# Altium project stlinkv2.PrjPcb
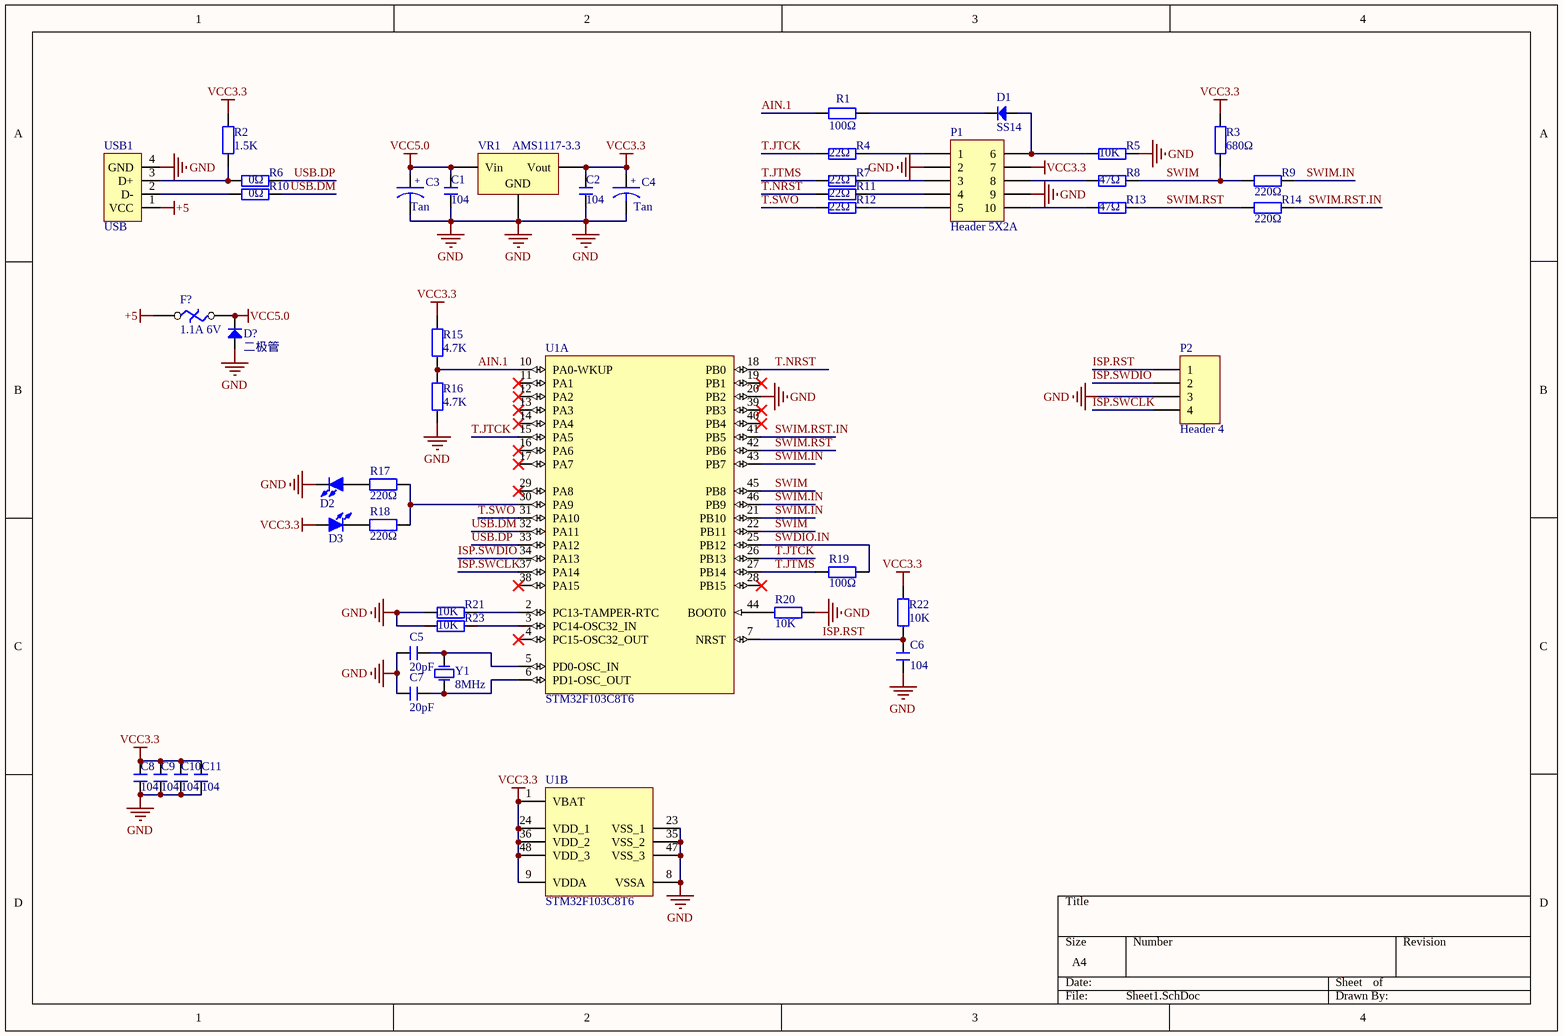
[diagram p0: Sheet1.SchDoc]
1 sheet, 45 parts. Net scope: global (net labels, ports and power ports of the same name join across sheets).
Board file: PCB1.PcbDoc

## Sheet Sheet1.SchDoc
size A4

### Parts
C1  104  [LC-1206_C]
C2  104  [LC-1206_C]
C3  Tan  [LC-CASE-A_3216]
C4  Tan  [LC-CASE-A_3216]
C5  20pF  [LC-1206_C]
C6  104  [LC-1206_C]
C7  20pF  [LC-1206_C]
C8  104  [LC-1206_C]
C9  104  [LC-1206_C]
C10  104  [LC-1206_C]
C11  104  [LC-1206_C]
D1  SS14  [LL4108]
D2  LED-SMD  [LC-0805_LED_S1]  (value not drawn)
D3  LED-SMD  [LC-0805_LED_S1]  (value not drawn)
D?  二极管  [LL4108]
F?  1.1A 6V  [LC-1206_R]
P1  Header 5X2A  [HDR2X5_CEN]
P2  Header 4  [HDR1X4]
R1  100Ω  [LC-0402_R]
R2  1.5K  [LC-0402_R]
R3  680Ω  [LC-0402_R]
R4  22Ω  [LC-0402_R]
R5  10K  [LC-0402_R]
R6  0Ω  [LC-0402_R]
R7  22Ω  [LC-0402_R]
R8  47Ω  [LC-0402_R]
R9  220Ω  [LC-0402_R]
R10  0Ω  [LC-0402_R]
R11  22Ω  [LC-0402_R]
R12  22Ω  [LC-0402_R]
R13  47Ω  [LC-0402_R]
R14  220Ω  [LC-0402_R]
R15  4.7K  [LC-0402_R]
R16  4.7K  [LC-0402_R]
R17  220Ω  [LC-0402_R]
R18  220Ω  [LC-0402_R]
R19  100Ω  [LC-0402_R]
R20  10K  [LC-0402_R]
R21  10K  [LC-0402_R]
R22  10K  [LC-0402_R]
R23  10K  [LC-0402_R]
U1  STM32F103C8T6  [STM-LQFP48_N]  (parts A,B of 2)
USB1  USB  [USB_A/P_B]
VR1  AMS1117-3.3  [LC-SOT-223]
Y1  8MHz  [OSC HC-49S]

### Nets
+5: F?.1 USB1.1(VCC)
GND: C1.2 C2.2 C3.2 C4.2 C5.1 C6.2 C7.1 C8.2 C9.2 C10.2 C11.2 D2.2(K) D?.1 P1.2 P1.9 P2.3 R5.1 R16.1 R20.1 R21.2 R23.2 U1.8(VSSA) U1.20(PB2) U1.23(VSS_1) U1.35(VSS_2) U1.47(VSS_3) USB1.4(GND) VR1.1(GND)
VCC3.3: C2.1 C4.1 C8.1 C9.1 C10.1 C11.1 D3.1(A) P1.7 R2.1 R3.1 R15.2 R22.1 U1.1(VBAT) U1.9(VDDA) U1.24(VDD_1) U1.36(VDD_2) U1.48(VDD_3) VR1.2(Vout)
VCC5.0: C1.1 C3.1 D?.2 F?.2 VR1.3(Vin)
AIN.1: R1.2 R15.1 R16.2 U1.10(PA0-WKUP)
ISP.RST: C6.1 P2.1 R22.2 U1.7(NRST)
ISP.SWCLK: P2.4 U1.37(PA14)
ISP.SWDIO: P2.2 U1.34(PA13)
SWDIO.IN: R19.1 U1.25(PB12)
SWIM: R3.2 R8.1 R9.1 U1.22(PB11) U1.45(PB8)
SWIM.IN: R9.2 U1.21(PB10) U1.43(PB7) U1.46(PB9)
SWIM.RST: R13.1 R14.1 U1.42(PB6)
SWIM.RST.IN: R14.2 U1.41(PB5)
T.JTCK: R4.2 U1.15(PA5) U1.26(PB13)
T.JTMS: R7.2 R19.2 U1.27(PB14)
T.NRST: R11.2 U1.18(PB0)
T.SWO: R12.2 U1.31(PA10)
USB.DM: R10.1 U1.32(PA11)
USB.DP: R6.1 U1.33(PA12)
NetC5_2: C5.2 U1.5(PD0-OSC_IN) Y1.2(OSC2)
NetC7_2: C7.2 U1.6(PD1-OSC_OUT) Y1.1(OSC1)
NetD1_1: D1.1 P1.6 R5.2
NetD1_2: D1.2 R1.1
NetD2_1: D2.1(A) R17.1
NetD3_2: D3.2(K) R18.1
NetP1_1: P1.1 R4.1
NetP1_3: P1.3 R7.1
NetP1_4: P1.4 R11.1
NetP1_5: P1.5 R12.1
NetP1_8: P1.8 R8.2
NetP1_10: P1.10 R13.2
NetR2_2: R2.2 R6.2 USB1.3(D+)
NetR10_2: R10.2 USB1.2(D-)
NetR17_2: R17.2 R18.2 U1.30(PA9)
NetR20_2: R20.2 U1.44(BOOT0)
NetR21_1: R21.1 U1.2(PC13-TAMPER-RTC)
NetR23_1: R23.1 U1.3(PC14-OSC32_IN)

Not connected (* = marked no-connect by the designer): U1 4(PC15-OSC32_OUT)* 11(PA1)* 12(PA2)* 13(PA3)* 14(PA4)* 16(PA6)* 17(PA7)* 19(PB1)* 28(PB15)* 29(PA8)* 38(PA15)* 39(PB3)* 40(PB4)*

### Notes on the sheet
- (in symbol CAP-T) +

### Library data of the parts
C1 C2 C5-C11 = C: 无极性贴片电容; 版权归属: 源创客; BOM名称: 无极性贴片电容; 学习资源: www.ooocke.com
C3 C4 = CAP-T: 钽电容
D1 D? = 二极管: 普通二极管
D2 D3 = LED-SMD: 贴片LED; 版权归属: 源创客; BOM名称: 贴片LED; 学习资源: www.ooocke.com
F? = F: 1206 贴片自恢复保险丝/保险管 PPTC MF-NSMF110-2 1.1A 6V
P1 = Header 5X2A: Header, 5-Pin, Dual row; LatestRevisionDate: 17-Jul-2002; LatestRevisionNote: Re-released for DXP Platform.; Publisher: Altium Limited
P2 = Header 4: Header, 4-Pin; LatestRevisionDate: 17-Jul-2002; LatestRevisionNote: Re-released for DXP Platform.; Publisher: Altium Limited
R1-R23 = R: 电阻; ComponentLink1Description: 供应商链接; ComponentLink1URL: http://www.szlcsc.com/product/details_24078.html; Package: 0603; Supplier: LC; SuppliersPartNumber: C23345
U1 = STM32F103C8T6: ARM Cortex-M3 32-bit MCU, 64 KB Flash, 20 KB Internal RAM, 37 I/Os, 48-pin LQFP, -40 to 85 degC, Tray; A/D Converter: 2x12-bit (10 Channel); FLASH Size (Prog) (kB): 64; I/Os (High Current): 37; Internal RAM Size (kB): 20; Operating Frequency(F) (Processor speed) (MHz): 72; Supply Voltage(Vcc) min (V): 2; DatasheetVersion: Rev. 16; PackageVersion: Rev. 6, 06/2013; PackageReference: LQFP48; PackageDescription: 48-Pin Low Profile Quad Flat Package, 7 x 7 mm Body, 0.5 mm Pitch; Supplier 1: Digi-Key; Supplier Part Number 1: 497-6063-ND; Supplier 2: Farnell; Supplier Part Number 2: 1447637; Supplier 3: Newark; Supplier Part Number 3: 59M2182; Supplier 4: Newark; Supplier Part Number 4: 57P1222; Supplier 5: Mouser; Supplier Part Number 5: 511-STM32F103C8T6; Core: ARM Cortex-M3; Packing: Tray; Mounting Technology: Surface Mount; PartNumber: STM32F103C8T6; ComponentLink1Description: Manufacturer URL; ComponentLink1URL: http://www.st.com/web/en/home.html; ComponentLink2Description: Datasheet; ComponentLink2URL: http://www.st.com/st-web-ui/static/active/en/resource/technical/document/datasheet/CD00161566.pdf; ComponentLink3Description: Package Specification; ComponentLink3URL: http://www.st.com/st-web-ui/static/active/en/resource/technical/document/datasheet/DM00058181.pdf
VR1 = SOT-223 AMS1117-3.3: 低压差线性稳压(LDO); ComponentLink1Description: 供应商链接; ComponentLink1URL: http://www.szlcsc.com/product/details_6652.html; Package: SOT-223; Supplier: LC; SuppliersPartNumber: C6186
Y1 = XTAL: 普通晶振; Published: 8-Jun-2000; LatestRevisionDate: 17-Jul-2002; LatestRevisionNote: Re-released for DXP Platform.; Publisher: Altium Limited